# Altium project Termocouple node.PrjPcb
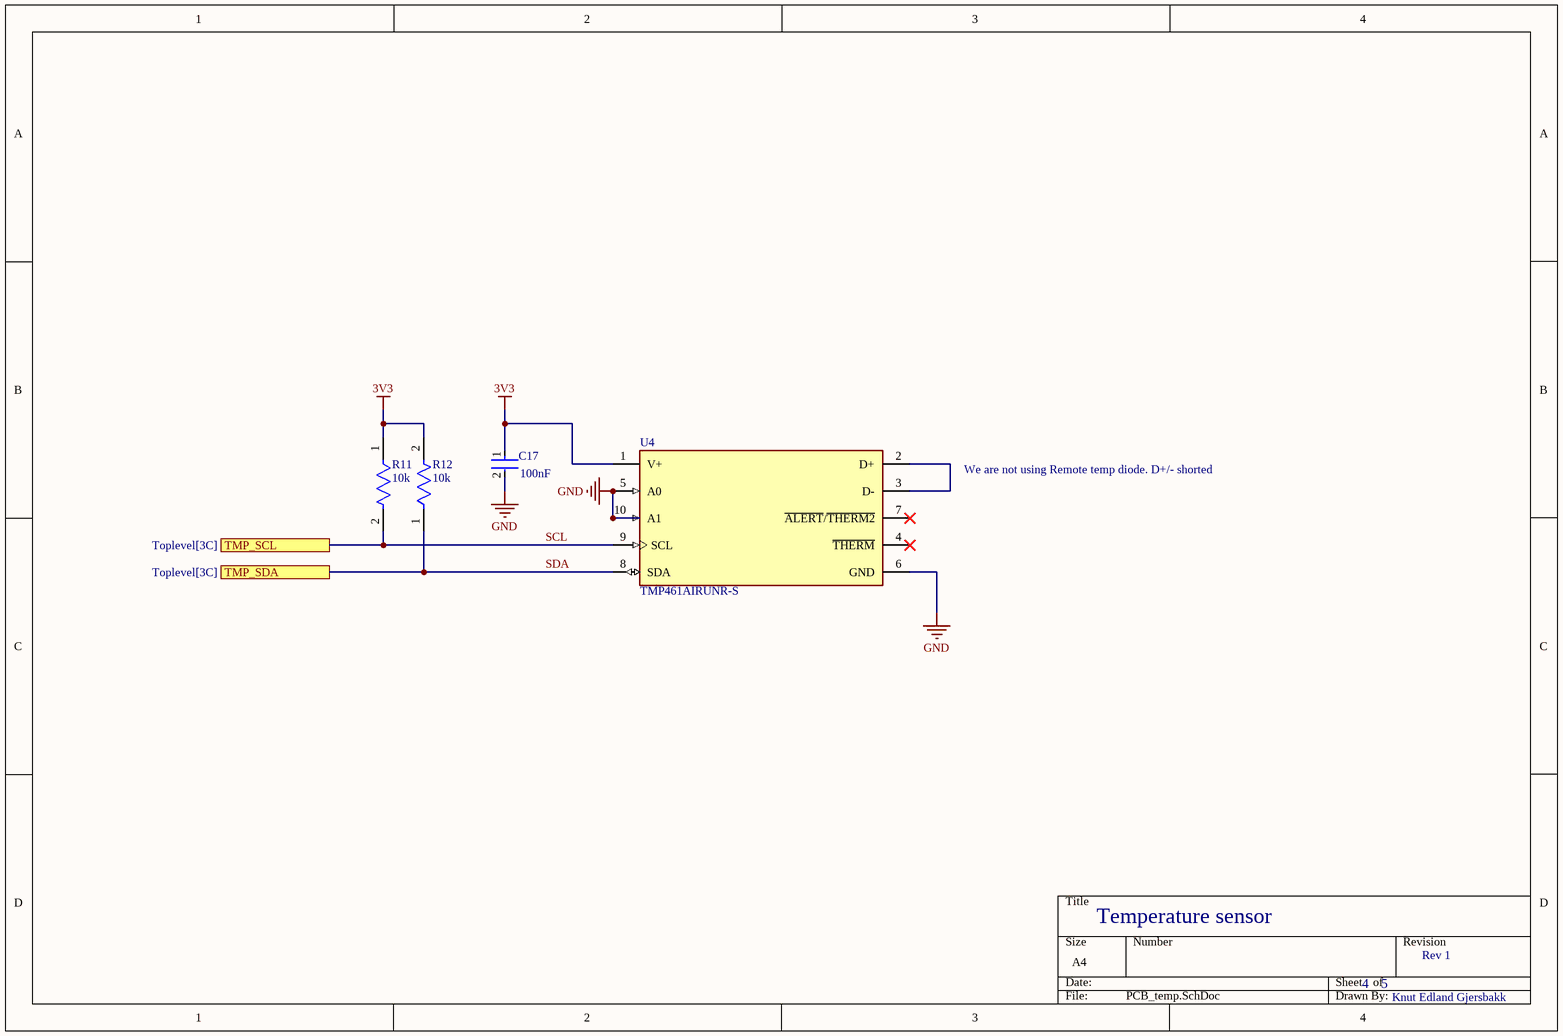
[diagram p0: PCB_temp.SchDoc]
2 sheets, 24 parts. Net scope: flat (ports and power ports of the same name join across sheets).
Board file: TermoCoupleNode.PcbDoc
Sheets:
  PCB_temp.SchDoc
  Termocouplers.SchDoc

## Sheet PCB_temp.SchDoc
size A4; SheetNumber: 4; SheetTotal: 5

### Parts
C17  100nF  [FP-CL10-IPC_A]
R11  10k  [FP-RT0603-IPC_C]
R12  10k  [FP-RT0603-IPC_C]
U4  TMP461AIRUNR-S  [FP-RUN0010A-MFG]

### Ports
TMP_SCL (see Toplevel[3C]), TMP_SDA (see Toplevel[3C])

### Nets
3V3: C17.1 R11.1 R12.2 U4.1(V+)
GND: C17.2 U4.5(A0) U4.6(GND) U4.10(A1)
SCL: R11.2 U4.9(SCL) ; port TMP_SCL
SDA: R12.1 U4.8(SDA) ; port TMP_SDA
NetU4_2: U4.2(D+) U4.3(D-)

Not connected (* = marked no-connect by the designer): U4 4(~{THERM})* 7(~{ALERT}/~{THERM2})*

### Notes on the sheet
- We are not using Remote temp diode. D+/- shorted
- Temperature sensor
- 4
- 5
- Rev 1
- Knut Edland Gjersbakk

### Library data of the parts
C17 = CMP-13271-002683-1: Cap Ceramic 100nF 16V X7R ±10% Pad SMD 0603 +125°C T/R; Voltage Rating: 16V; Max Operating Temperature: 125°C; Capacitance: 100nF; Features: Soft Termination; Length: 0.063inch; Packaging: Tape and Reel; Min Operating Temperature: -55°C; Mount: Surface Mount; Case/Package: 0603; Case Code (Metric): 1608; Width: 0.031inch; Ratings: AEC-Q200; Thickness: 0.035inch; Case Code (Imperial): 0603; Tolerance: 10%
R11 R12 = CMP-03412-005349-1: RES SMD 10K OHM 1% 1/10W 0603 / RT0603FRE0710KL; Manufacturer: Yageo; Value: 10KΩ; Temperature Coefficient: 50 ppm/°C; Power Rating: 0.1W; Tolerance: 0.01; Voltage Rating: 75V; RoHS: TRUE; Category: Res; Automotive: No; Digikey Description: RES SMD 10K OHM 1% 1/10W 0603; ComponentLink2Description: Datasheet; Octopart: https://octopart.com/rt0603fre0710kl-yageo-40009243; ComponentLink2URL: http://www.yageo.com/documents/recent/PYu-RT_1-to-0.01_RoHS_L_9.pdf; Device Class L3: Chip SMD Resistors; Device Class L1: Passive Components; Temperature Range High: +155°C; Height: 0.55mm; Composition: Thin Film; Ipc Land Pattern Name: RESC16080X45; Series: RT; Package: RT0603; Resistance: 10KΩ; Footprint Url: http://www.yageo.com/exep/pages/download/literatures/PYu-R_Mount_10.pdf; Temperature: -55°C to +155°C; Temperature Range Low: -55°C; Lead Free: Yes; Device Class L2: Resistors; Mouser Description: Thin Film Resistors - SMD 10K ohm 1% 1/10W; Manufacturer Part Number: RT0603FRE0710KL
U4 = CMP-00370-103943066-1: TMP461AIRUNR-S Temperature Sensor Digital, Local/Remote -40°C ~ 125°C 11 b 10-WQFN (2x2); Manufacturer Lifecycle Status: ACTIVE; NexarPartId: 103943066; Height: 0m; Thickness: 750µm; Number of Pins: 10; Schedule B: 8542390000, 8542390000; Width: 2mm; Length: 2mm; Lifecycle Status: Production

## Sheet Termocouplers.SchDoc
size A3; SheetNumber: 5; SheetTotal: 5
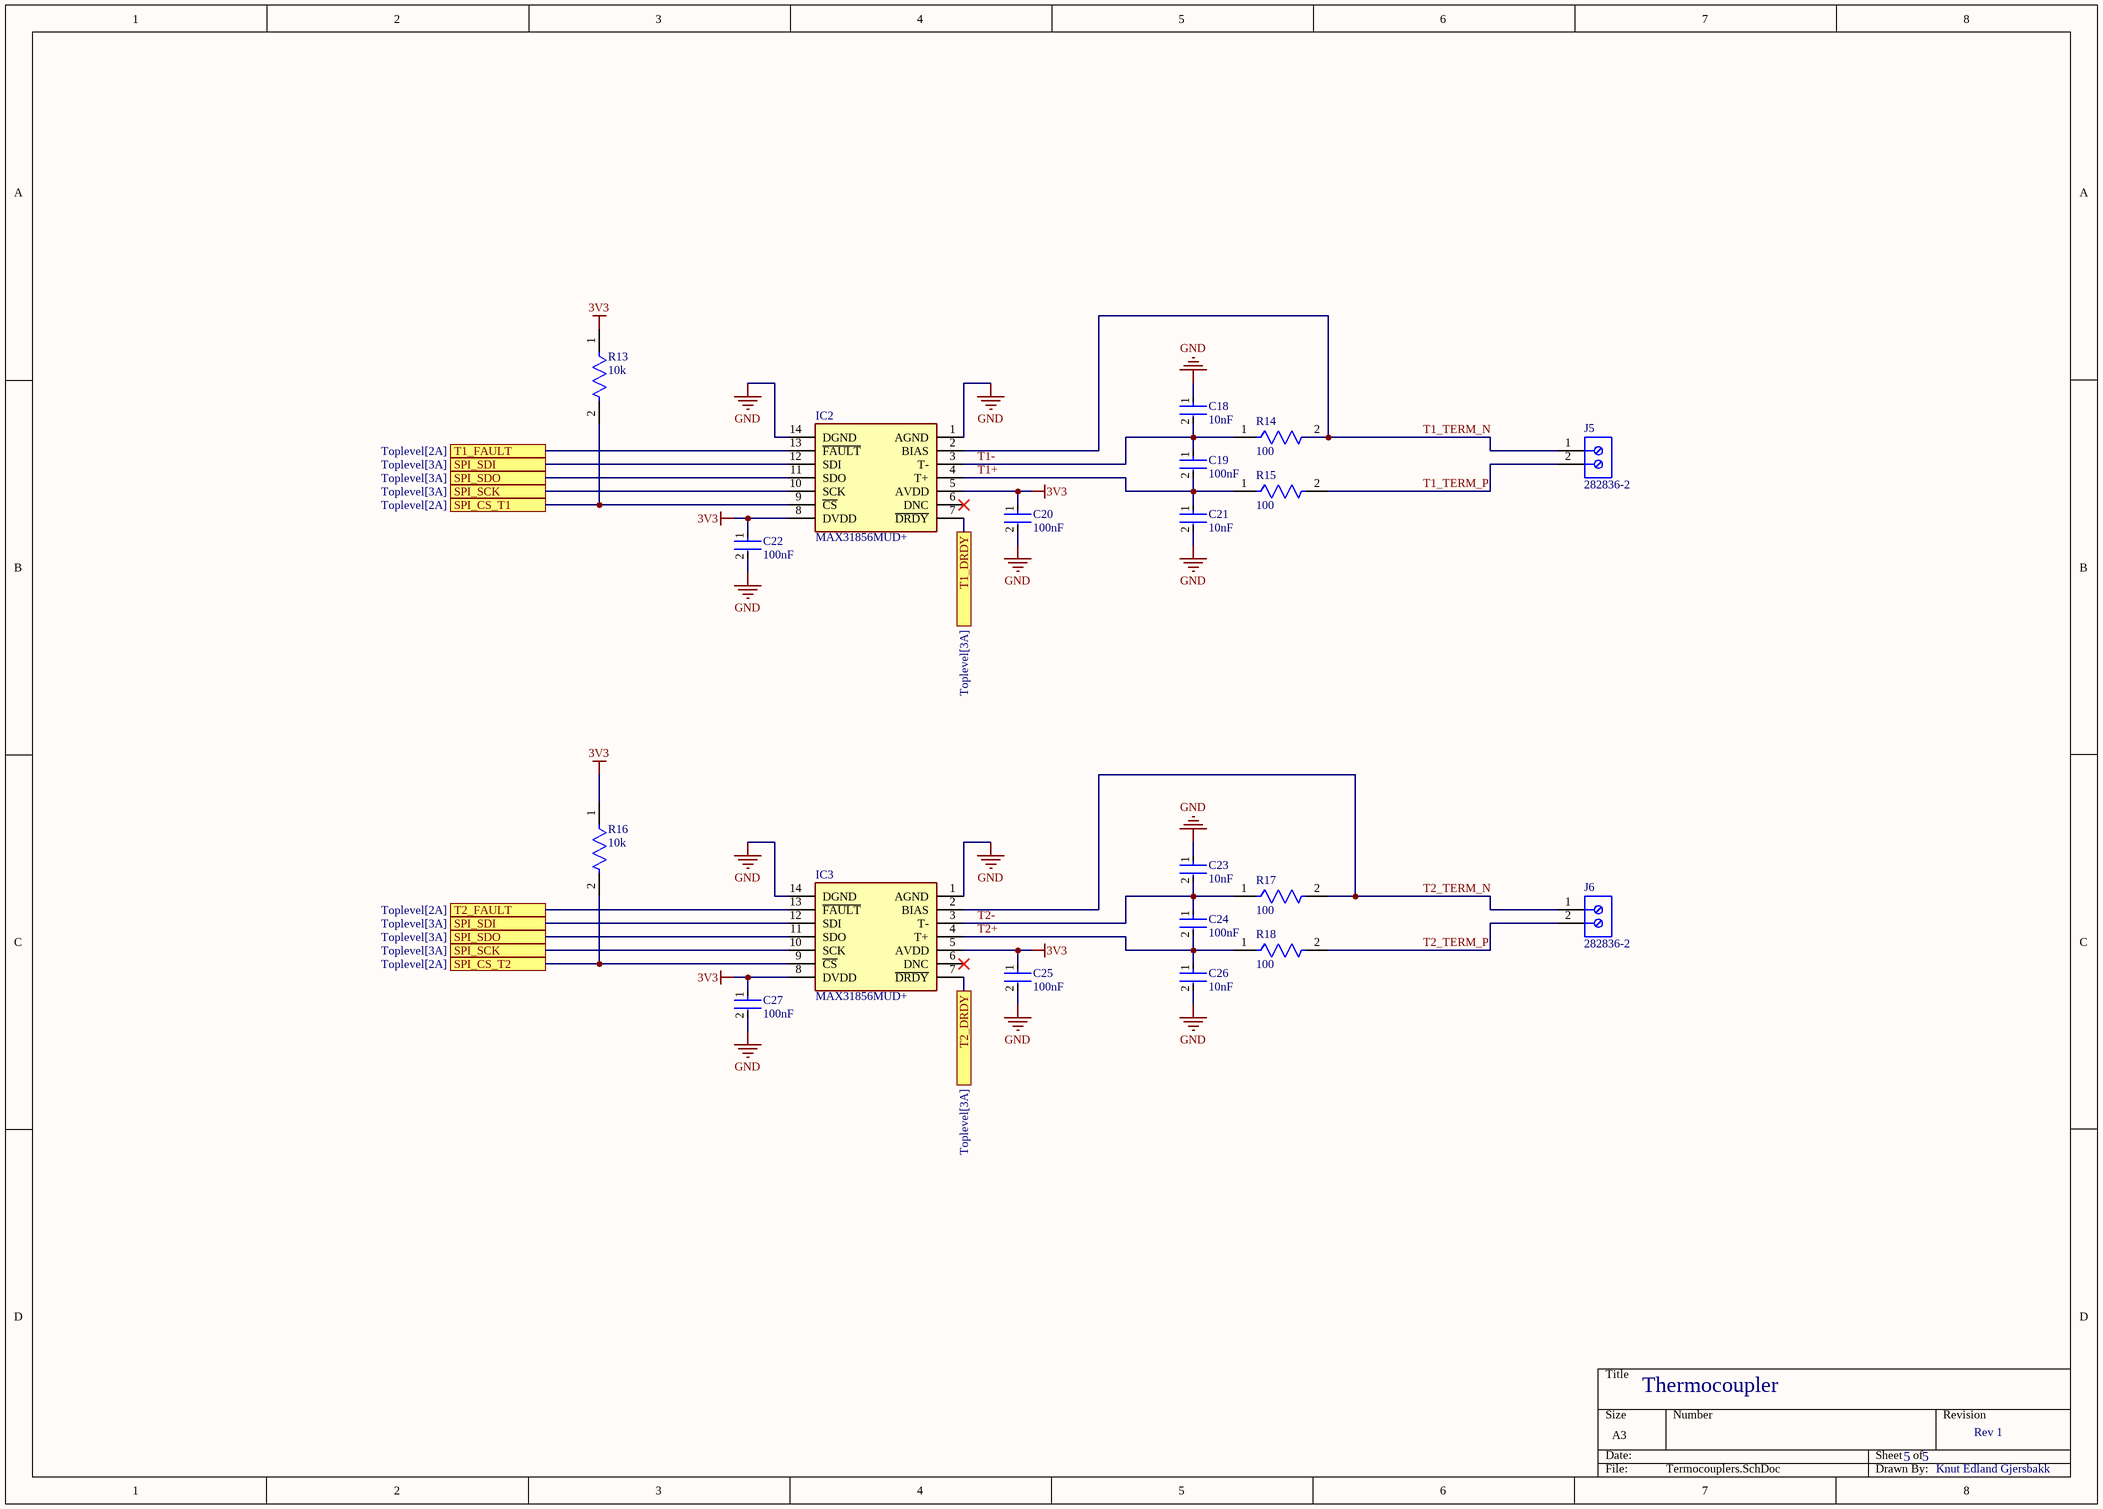
[diagram p1: Termocouplers.SchDoc]

### Parts
C18  10nF  [FP-GCM188-0_1-MFG]
C19  100nF  [FP-GCM188-0_1-IPC_B]
C20  100nF  [FP-GCM188-0_1-IPC_B]
C21  10nF  [FP-GCM188-0_1-MFG]
C22  100nF  [FP-GCM188-0_1-IPC_B]
C23  10nF  [FP-GCM188-0_1-MFG]
C24  100nF  [FP-GCM188-0_1-IPC_B]
C25  100nF  [FP-GCM188-0_1-IPC_B]
C26  10nF  [FP-GCM188-0_1-MFG]
C27  100nF  [FP-GCM188-0_1-IPC_B]
IC2  MAX31856MUD+  [SOP65P640X110-14N]
IC3  MAX31856MUD+  [SOP65P640X110-14N]
J5  282836-2  [TECO-282836-2_V]
J6  282836-2  [TECO-282836-2_V]
R13  10k  [FP-RT0603-IPC_C]
R14  100  [FP-CR0603-IPC_A]
R15  100  [FP-CR0603-IPC_A]
R16  10k  [FP-RT0603-IPC_C]
R17  100  [FP-CR0603-IPC_A]
R18  100  [FP-CR0603-IPC_A]

### Ports
SPI_CS_T1 (see Toplevel[2A]), SPI_CS_T2 (see Toplevel[2A]), SPI_SCK (see Toplevel[3A]), SPI_SDI (see Toplevel[3A]), SPI_SDO (see Toplevel[3A]), T1_DRDY (see Toplevel[3A]), T1_FAULT (see Toplevel[2A]), T2_DRDY (see Toplevel[3A]), T2_FAULT (see Toplevel[2A])

### Nets
3V3: C20.1 C22.1 C25.1 C27.1 IC2.5(AVDD) IC2.8(DVDD) IC3.5(AVDD) IC3.8(DVDD) R13.1 R16.1
GND: C18.1 C20.2 C21.2 C22.2 C23.1 C25.2 C26.2 C27.2 IC2.1(AGND) IC2.14(DGND) IC3.1(AGND) IC3.14(DGND)
T1+: C19.2 C21.1 IC2.4(T+) R15.1
T1-: C18.2 C19.1 IC2.3(T-) R14.1
T1_TERM_N: IC2.2(BIAS) J5.1 R14.2
T1_TERM_P: J5.2 R15.2
T2+: C24.2 C26.1 IC3.4(T+) R18.1
T2-: C23.2 C24.1 IC3.3(T-) R17.1
T2_TERM_N: IC3.2(BIAS) J6.1 R17.2
T2_TERM_P: J6.2 R18.2
NetIC2_7: IC2.7(~{DRDY}) ; port T1_DRDY
NetIC2_9: IC2.9(~{CS}) R13.2 ; port SPI_CS_T1
NetIC2_10: IC2.10(SCK) IC3.10(SCK) ; port SPI_SCK
NetIC2_11: IC2.11(SDO) IC3.11(SDO) ; port SPI_SDO
NetIC2_12: IC2.12(SDI) IC3.12(SDI) ; port SPI_SDI
NetIC2_13: IC2.13(~{FAULT}) ; port T1_FAULT
NetIC3_7: IC3.7(~{DRDY}) ; port T2_DRDY
NetIC3_9: IC3.9(~{CS}) R16.2 ; port SPI_CS_T2
NetIC3_13: IC3.13(~{FAULT}) ; port T2_FAULT

Not connected (* = marked no-connect by the designer): IC2 6(DNC)*; IC3 6(DNC)*

### Notes on the sheet
- Thermocoupler
- 5
- Rev 1
- Knut Edland Gjersbakk

### Library data of the parts
C18 C21 C23 C26 = CMP-2006-02392-2: Ceramic Capacitor for Automotive 10nF  ±10% 100VDC X7R 0603 Paper T/R; Voltage: 100V; REACH SVHC: No SVHC; Width: 0.8mm; Termination: SMD/SMT; Voltage Rating: 100V; Tolerance: 10%; Depth: 0.8mm; Voltage Rating (DC): 100V; Length: 1.6mm; Lead Free: Lead Free; Radiation Hardening: No; Package Quantity: 1; Height: 0.8mm; Case Code (Imperial): 0603; Max Operating Temperature: 125°C; Case Code (Metric): 1608; Packaging: Tape and Reel; Mount: Surface Mount; Dielectric: X7R; Capacitance: 10nF; Thickness: 0.035inch; Case/Package: 0603; Min Operating Temperature: -55°C; Ratings: AEC-Q200
C19 C20 C22 C24 C25 C27 = CMP-2006-02353-3: Ceramic Capacitor for Automotive 100nF  ±10% 50VDC X8L 0603 Paper T/R; Voltage Rating: 50V; Height: 0.8mm; Lead Free: Lead Free; Case/Package: 0603; Dielectric: X8L; Packaging: Tape and Reel; Termination: SMD/SMT; Package Quantity: 4000; Width: 0.5mm; Max Operating Temperature: 150°C; Case Code (Metric): 1608; Thickness: 0.035inch; Capacitance: 100nF; Tolerance: 10%; Voltage Rating (DC): 50V; Ratings: AEC-Q200; Case Code (Imperial): 0603; Voltage: 50V; Depth: 0.8mm; Radiation Hardening: No; Length: 1.6mm; Mount: Surface Mount; Min Operating Temperature: -55°C
IC2 IC3 = MAX31856MUD+: Integrated Circuit; Manufacturer_Name: Analog Devices; Datasheet Link: https://componentsearchengine.com/Datasheets/2/MAX31856MUD+.pdf; Height: 1.1mm; Manufacturer_Part_Number: MAX31856MUD+; Mouser Part Number: 700-MAX31856MUD+; Mouser Price/Stock: https://www.mouser.co.uk/ProductDetail/Analog-Devices-Maxim-Integrated/MAX31856MUD%2b?qs=sO%2FZ8XQFeM1TlxwAJsKRYw%3D%3D; Arrow Part Number: MAX31856MUD+; Arrow Price/Stock: https://www.arrow.com/en/products/max31856mud/analog-devices?utm_currency=USD&region=nac
J5 J6 = CMP-1684-00017-1: Female Header, Pitch 5 mm, 1 x 2 Position, Height 10 mm, Tail Length 3.5 mm, Rohs, Bulk; Manufacturer: TE Connectivity; Wire Gauge: 16-30AWG; Product Training Modules: Wire-to-BoardEurostyleTerminalBlocks; Clamp Material - Plating: Brass-NickelPlated; Voltage: 300V; Mating Orientation: HorizontalwithBoard; Current: 13.5A; Pitch: 0.197"(5.00mm); Screw Thread: M3; 3D Model: 282836-2.pdf; Other Names: 5ULV-02B / A98076; Dynamic Catalog: BuchananSeries; Number of Levels: 1; Torque - Screw: 0.68Nm(6Lb-In); Featured Product: EurostyleTerminalBlockConnectors; Positions Per Level: 2; Wire Termination: Screw-RisingCageClamp; Datasheet URL: http://www.te.com.cn/commerce/DocumentDelivery/DDEController?Action=showdoc&DocId=Catalog+Section%7F1308389_EUROSTYLE_TERMINAL_BLOCKS%7F0607%7Fpdf%7FEnglish%7FENG_CS_1308389_EUROSTYLE_TERMINAL_BLOCKS_0607.pdf%7F282836-2; Color: Green; Family: TerminalBlocks-WiretoBoard; RoHS Information: 282836-2StatementofCompliance; Standard Package: 300; Contact Material - Plating: Brass-TinPlated; Manufacturer URL: http://www.te.com; Housing Material: Polyamide(PA66),Nylon6/6; Features: Interlocking(Side); Package Description: Female Header, Pitch 5 mm, 1 x 2 Position, Height 10 mm, Tail Length 3.5 mm; Mounting Type: ThroughHole; Package Reference: THD; Packaging: Bulk; Series: Buchanan; Category: Connectors,Interconnects; Screw Material - Plating: Brass-NickelPlated
R13 R16 = CMP-03412-005349-1: as R11 on sheet PCB_temp; RoHS: TRUE; Category: Res; Automotive: No; Digikey Description: RES SMD 10K OHM 1% 1/10W 0603; ComponentLink2Description: Datasheet; Octopart: https://octopart.com/rt0603fre0710kl-yageo-40009243; ComponentLink2URL: http://www.yageo.com/documents/recent/PYu-RT_1-to-0.01_RoHS_L_9.pdf; Device Class L3: Chip SMD Resistors; Device Class L1: Passive Components; Temperature Range High: +155°C; Height: 0.55mm; Composition: Thin Film; Ipc Land Pattern Name: RESC16080X45; Series: RT; Package: RT0603; Resistance: 10KΩ; Footprint Url: http://www.yageo.com/exep/pages/download/literatures/PYu-R_Mount_10.pdf; Temperature: -55°C to +155°C; Temperature Range Low: -55°C; Lead Free: Yes; Device Class L2: Resistors; Mouser Description: Thin Film Resistors - SMD 10K ohm 1% 1/10W; Manufacturer Part Number: RT0603FRE0710KL
R14 R15 R17 R18 = CMP-07231-000376-1: AEC-Q200 Compliant Chip Resistors 0603 100Ω 0.1W 1% 100ppm/°C

## Nets that join several sheets
3V3: PCB_temp (C17.1 R11.1 R12.2 U4.1), Termocouplers (10 pins)
GND: PCB_temp (C17.2 U4.5 U4.6 U4.10), Termocouplers (12 pins)